# Altium schematic sheet JBC_PD_Top.SchDoc
size A4
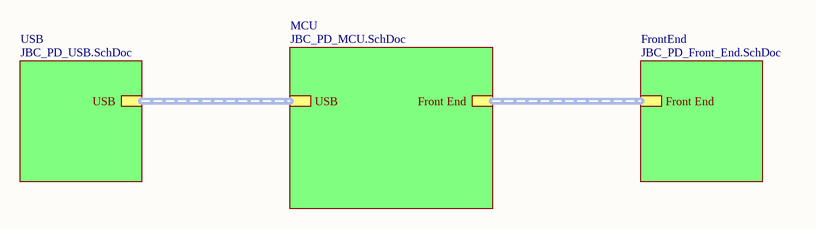
[diagram p0: JBC_PD_Top.SchDoc]

## Sub-sheets
FrontEnd = JBC_PD_Front_End.SchDoc: Front End (harness Front End)
MCU = JBC_PD_MCU.SchDoc: USB (harness USB), Front End (harness Front End)
USB = JBC_PD_USB.SchDoc: USB (harness USB)

## Buses and harness runs
harness sheet FrontEnd/Front End = sheet MCU/Front End
harness sheet MCU/USB = sheet USB/USB